# EAGLE design Carolo_schaltplan (EAGLE 9.5.2)
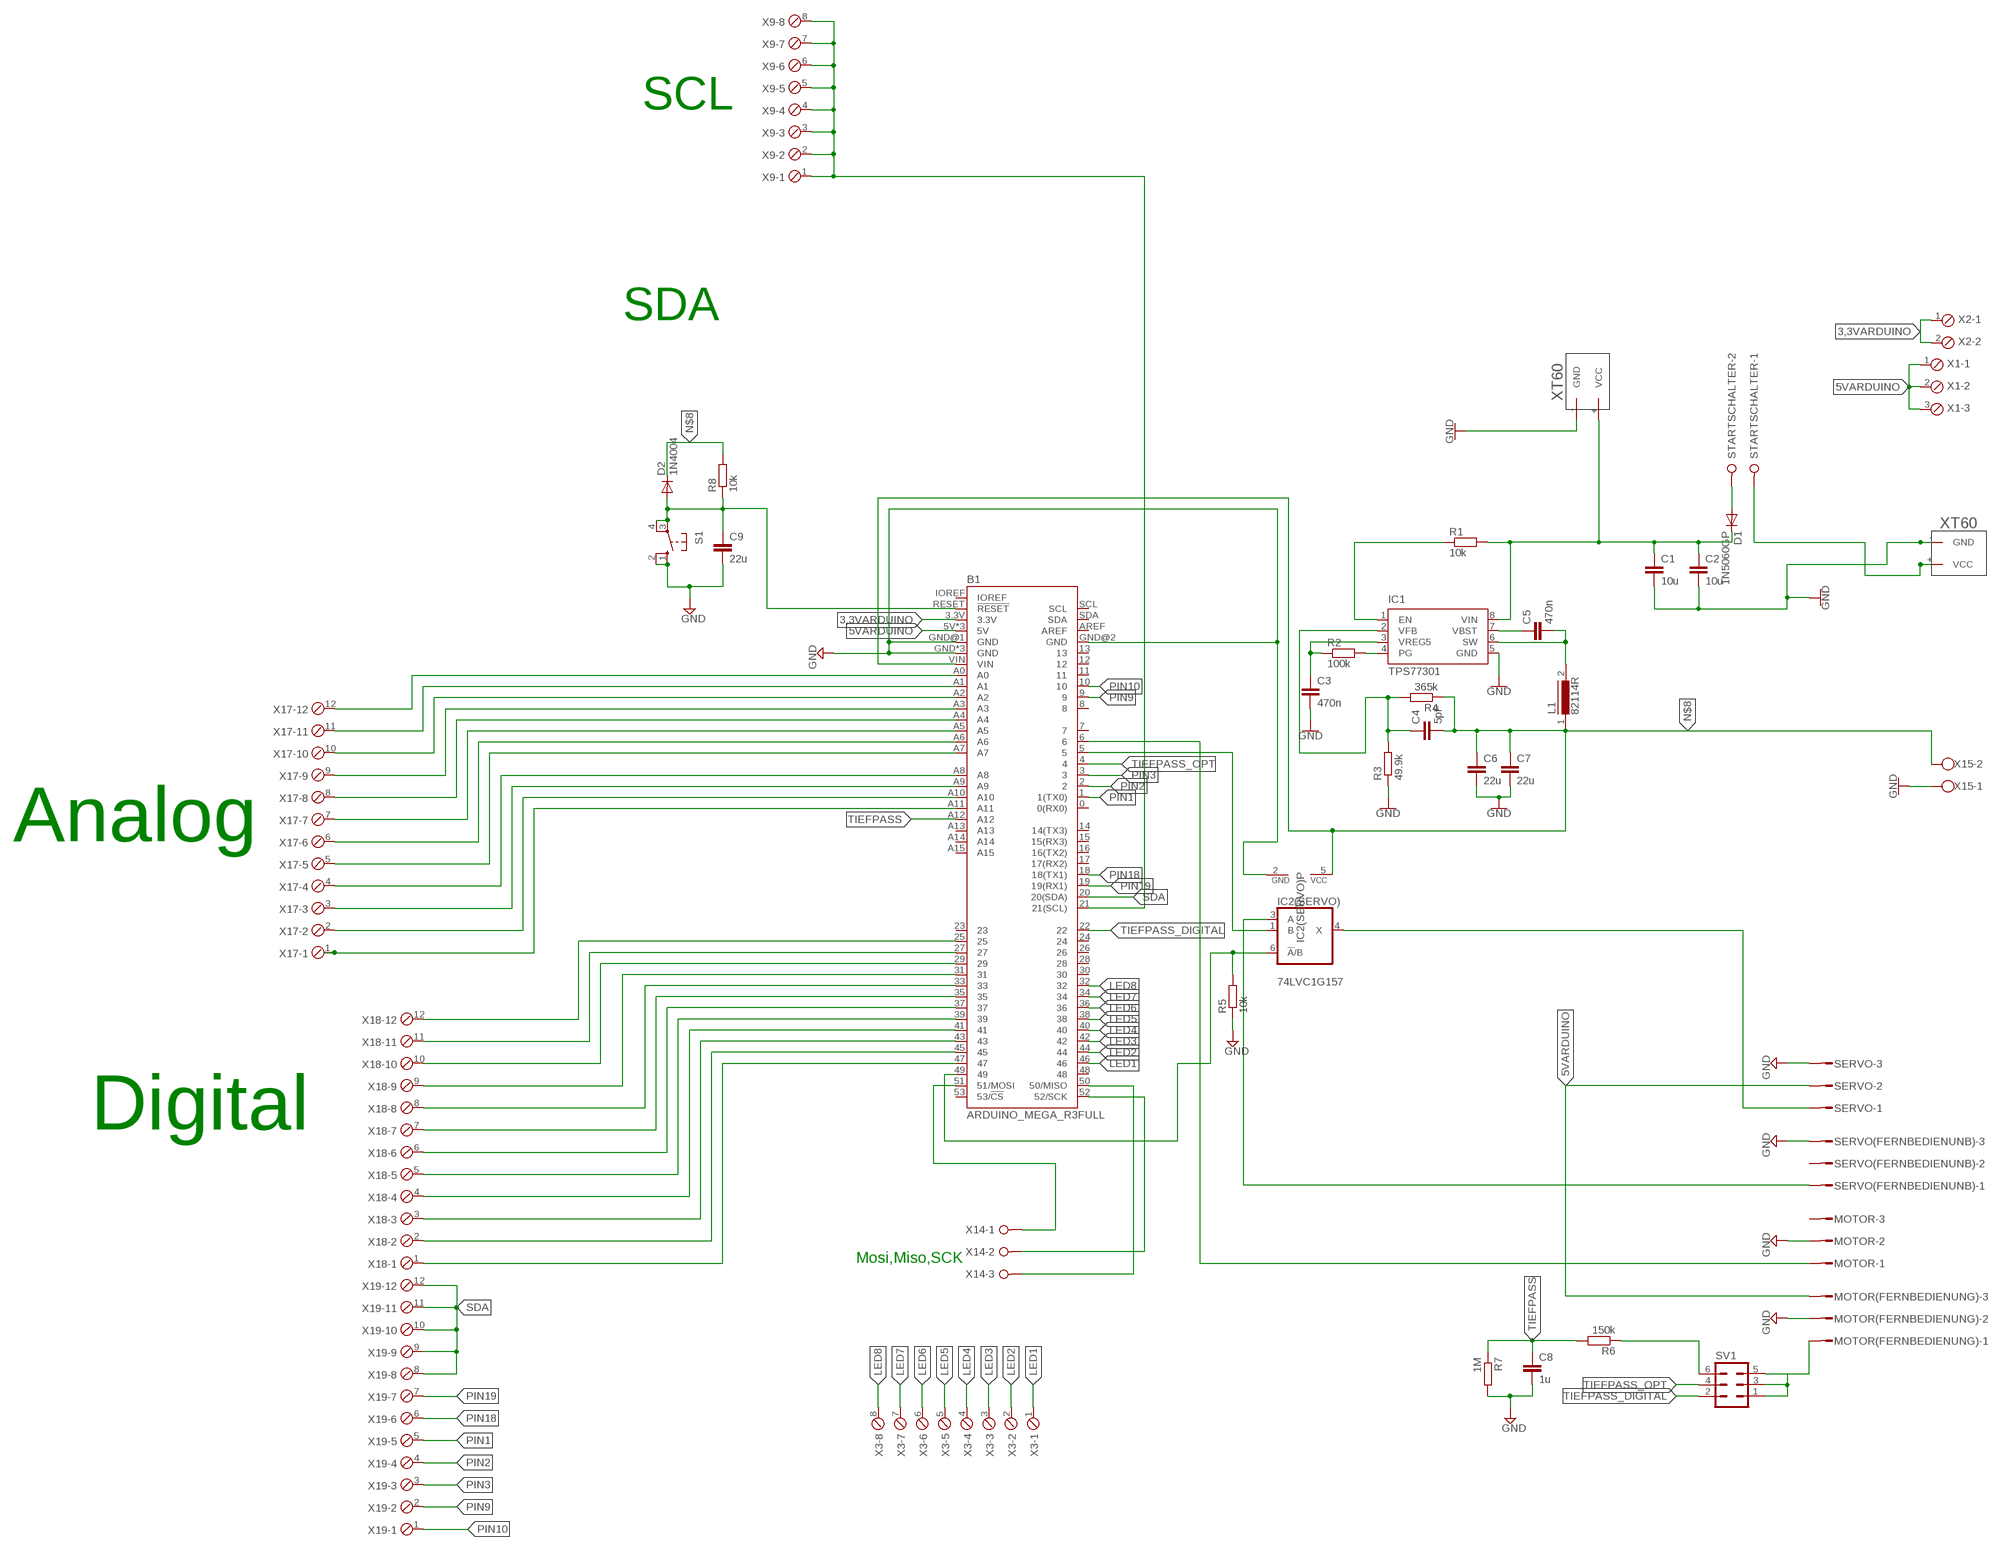
[diagram p0: schematic, sheet 1]

## Parts
B1  ARDUINO_MEGA_R3FULL  [ARDUINO_MEGA_NO_SILK]
C1  10u  C5/2.5  [C5B2.5]
C2  10u  C5/2.5  [C5B2.5]
C3  470n  C5/2.5  [C5B2.5]
C4  5pF  C5/2.5  [C5B2.5]
C5  470n  C5/2.5  [C5B2.5]
C6  22u  C5/2.5  [C5B2.5]
C7  22u  C5/2.5  [C5B2.5]
C8  1u  C5/2.5  [C5B2.5]
C9  22u  C5/2.5  [C5B2.5]
D1  1N5060GP  [DO15-12]
D2  1N4004  [DO41-10]
IC1  TPS77301  [SOP-08]
IC2(SERVO)  74LVC1G157  741G3157DBVR  [DBV_R-PDSO-G6]
L1  82114R  [82114R]
MOTOR  L03P  [L03P]
MOTOR(FERNBEDIENUNG)  L03P  [L03P]
R1  10k  R-EU_0309/12  [0309/12]
R2  100k  R-EU_0309/12  [0309/12]
R3  49.9k  R-EU_0309/12  [0309/12]
R4  365k  R-EU_0309/12  [0309/12]
R5  10k  R-EU_0309/12  [0309/12]
R6  150k  R-EU_0309/12  [0309/12]
R7  1M  R-EU_0309/12  [0309/12]
R8  10k  R-EU_0309/12  [0309/12]
S1  10-XX  [B3F-10XX]
SERVO  L03P  [L03P]
SERVO(FERNBEDIENUNB)  L03P  [L03P]
STARTSCHALTER  W237-02P  [W237-132]
SV1  ML6  [ML6]
U$1  XT60  [XT60]
U$2  XT60  [XT60]
X1  MPT3  [3POL254]
X2  MPT2  [2POL254]
X3  MPT8  [8POL254]
X9  MPT8  [8POL254]
X14  W237-03P  [W237-133]
X15  W237-102  [W237-102]
X17  MPT12  [12POL254]
X18  MPT12  [12POL254]
X19  MPT12  [12POL254]

## Nets
3,3VARDUINO: B1.3.3V X2.1 X2.2
5VARDUINO: B1.5V B1.5V@1(5V) B1.5V@2(5V) MOTOR(FERNBEDIENUNG).3 SERVO.2 X1.1 X1.2 X1.3
D22: B1.25 X18.12
D24: B1.29 X18.10
D26: B1.33 X18.8
GND: B1.GND B1.GND@1(GND) B1.GND@2(GND) B1.GND@3(GND) B1.GND@4(GND) C1.2 C2.2 C3.2 C6.2 C7.2 C8.2 C9.2 IC1.5(GND) IC2(SERVO).2(GND) MOTOR(FERNBEDIENUNG).2 MOTOR.2 R3.1 R5.1 R7.2 S1.1(S) S1.2(S1) SERVO(FERNBEDIENUNB).3 SERVO.3 U$1.-(GND) U$2.-(GND) X15.1
LED1: B1.46 X3.1
LED2: B1.44 X3.2
LED3: B1.42 X3.3
LED4: B1.40 X3.4
LED5: B1.38 X3.5
LED6: B1.36 X3.6
LED7: B1.34 X3.7
LED8: B1.32 X3.8
N$1: B1.RESET(!RESET) C9.1 D2.A R8.1 S1.3(P) S1.4(P1)
N$2: C1.1 C2.1 D1.C IC1.8(VIN) R1.2 U$2.+(VCC)
N$3: C4.1 IC1.2(VFB) R3.2 R4.2
N$4: IC1.4(PG) R2.2
N$5: B1.27 X18.11
N$7: C5.1 IC1.7(VBST)
N$8: B1.VIN C4.2 C6.1 C7.1 D2.C IC2(SERVO).5(VCC) L1.1 R4.1 R8.2 X15.2
N$9: B1.A0 X17.12
N$11: STARTSCHALTER.1 U$1.+(VCC)
N$12: B1.31 X18.9
N$13: IC2(SERVO).4(X) SERVO.1
N$14: B1.5 IC2(SERVO).1(B)
N$15: D1.A STARTSCHALTER.2
N$16: IC2(SERVO).3(A) SERVO(FERNBEDIENUNB).1
N$17: B1.6 MOTOR.1
N$18: B1.A2 X17.10
N$19: B1.A3 X17.9
N$20: B1.A4 X17.8
N$21: B1.A5 X17.7
N$22: B1.A6 X17.6
N$23: B1.A7 X17.5
N$24: B1.A8 X17.4
N$25: B1.A9 X17.3
N$26: B1.A10 X17.2
N$27: B1.A11 X17.1
N$28: B1.35 X18.7
N$29: B1.21(21(SCL)) X9.1 X9.2 X9.3 X9.4 X9.5 X9.6 X9.7 X9.8
N$30: B1.37 X18.6
N$31: B1.39 X18.5
N$32: B1.41 X18.4
N$33: B1.43 X18.3
N$34: B1.45 X18.2
N$35: B1.47 X18.1
N$36: B1.52(52/SCK) X14.2
N$37: R6.1 SV1.6
N$38: MOTOR(FERNBEDIENUNG).1 SV1.1 SV1.3 SV1.5
N$41: IC1.1(EN) R1.1
N$42: B1.51(51/MOSI) X14.1
N$44: B1.50(50/MISO) X14.3
N$51: C5.2 IC1.6(SW) L1.2
N$52: C3.1 IC1.3(VREG5) R2.1
N$55: B1.A1 X17.11
PIN1: B1.1(1(TX0)) X19.5
PIN2: B1.2 X19.4
PIN3: B1.3 X19.3
PIN9: B1.9 X19.2
PIN10: B1.10 X19.1
PIN18: B1.18(18(TX1)) X19.6
PIN19: B1.19(19(RX1)) X19.7
SDA: B1.20(20(SDA)) X19.8 X19.9 X19.10 X19.11 X19.12
SL: B1.49 IC2(SERVO).6(!A!/B) R5.2
TIEFPASS: B1.A12 C8.1 R6.2 R7.1
TIEFPASS_DIGITAL: B1.22 SV1.2
TIEFPASS_OPT: B1.4 SV1.4
Unconnected: B1.0(0(RX0)) B1.7 B1.8 B1.11 B1.12 B1.13 B1.14(14(TX3)) B1.15(15(RX3)) B1.16(16(TX2)) B1.17(17(RX2)) B1.23 B1.24 B1.26 B1.28 B1.30 B1.48 B1.53(53/!CS) B1.A13 B1.A14 B1.A15 B1.AREF B1.IOREF B1.SCL B1.SDA MOTOR.3 SERVO(FERNBEDIENUNB).2

## Notes on the sheet
- SCL
- SDA
- Analog
- Digital
- Mosi,Miso,SCK

## Library data of the parts
B1 = SparkFun-Boards:ARDUINO_MEGA_R3: Arduino Mega R3 ATmega2560 R3 compatible footprint. SparkFun Products: Arduino Mega 2560 R3 <https://www.sparkfun.com/products/11061>
C1-C9 = capacitor-wima:C: CAPACITOR naming: grid - package width
D1 = diode:1N5060GP: DIODE controlled avalanche rectifier
D2 = diode:1N4004: DIODE general purpose rectifier, 1 A
IC1 = texas:TPS773*: 250-mA LDO REGULATORS WITH RESET OUTPUT WITH 8-PIN MSOP PACKAGING Source: http://focus.ti.com/lit/ds/symlink/tps77333.pdf; MF: TEXAS INSTRUMENT CONNECTORS; MPN: TPS77301DGK; OC_FARNELL: 1510194; OC_NEWARK: 77C1213
IC2(SERVO) = 74xx-little-us:74*1G3157: Single-Pole, Double-Throw Analog Switch Source: http://focus.ti.com/lit/ds/symlink/sn74lvc1g3157.pdf
L1 = inductors:82114R: INDUCTOR
MOTOR MOTOR(FERNBEDIENUNG) SERVO SERVO(FERNBEDIENUNB) = con-amp-mt:L03P: AMP MT CONNECTOR; OC_FARNELL: unknown; OC_NEWARK: unknown
R1-R8 = resistor:R-EU_: RESISTOR, European symbol
S1 = switch-omron:10-XX: OMRON SWITCH; MPN: B3F-1000; OC_FARNELL: 176432; OC_NEWARK: 36M3542
STARTSCHALTER = con-wago-508:W237-02P: WAGO SREW CLAMP; OC_FARNELL: unknown; OC_NEWARK: unknown
SV1 = con-harting-ml:ML6: HARTING; OC_FARNELL: unknown; OC_NEWARK: unknown
U$1 U$2 = XT60:XT60: XT60
X1 = con-phoenix-254:MPT3: PHOENIX CONNECTOR; OC_FARNELL: unknown; OC_NEWARK: unknown
X2 = con-phoenix-254:MPT2: PHOENIX CONNECTOR; OC_FARNELL: unknown; OC_NEWARK: unknown
X3 X9 = con-phoenix-254:MPT8: PHOENIX CONNECTOR; OC_FARNELL: unknown; OC_NEWARK: unknown
X14 = con-wago-508:W237-03P: WAGO SREW CLAMP; OC_FARNELL: unknown; OC_NEWARK: unknown
X15 = con-wago-500:W237-102: WAGO SCREW CLAMP; MPN: 237-102; OC_FARNELL: unknown; OC_NEWARK: 70K9898
X17-X19 = con-phoenix-254:MPT12: PHOENIX CONNECTOR; OC_FARNELL: unknown; OC_NEWARK: unknown

## Board
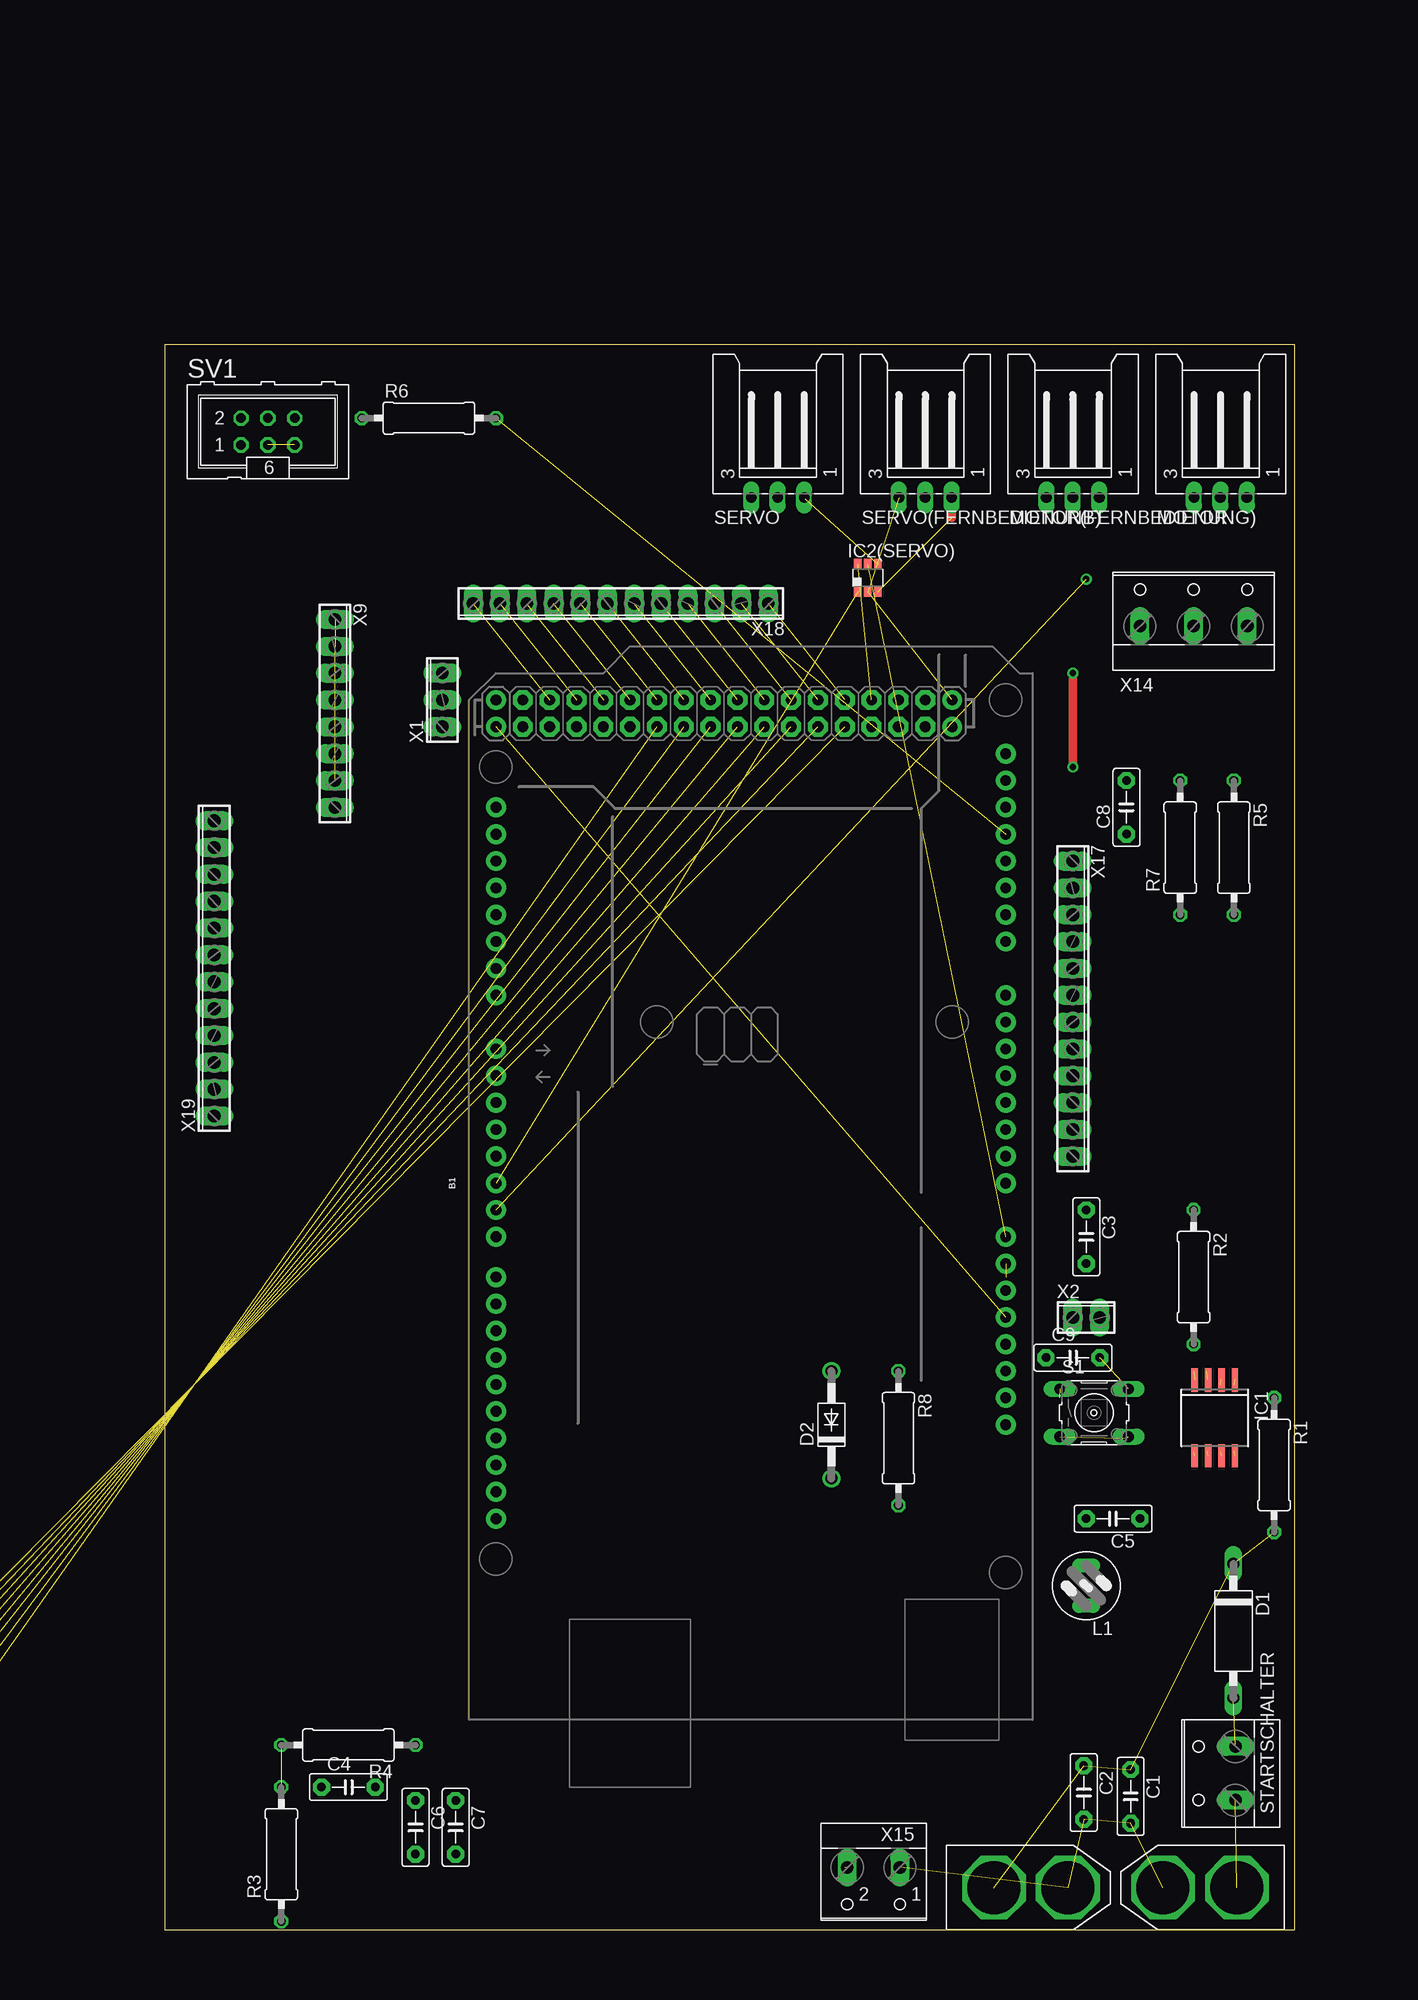
[diagram p1: board, top side]
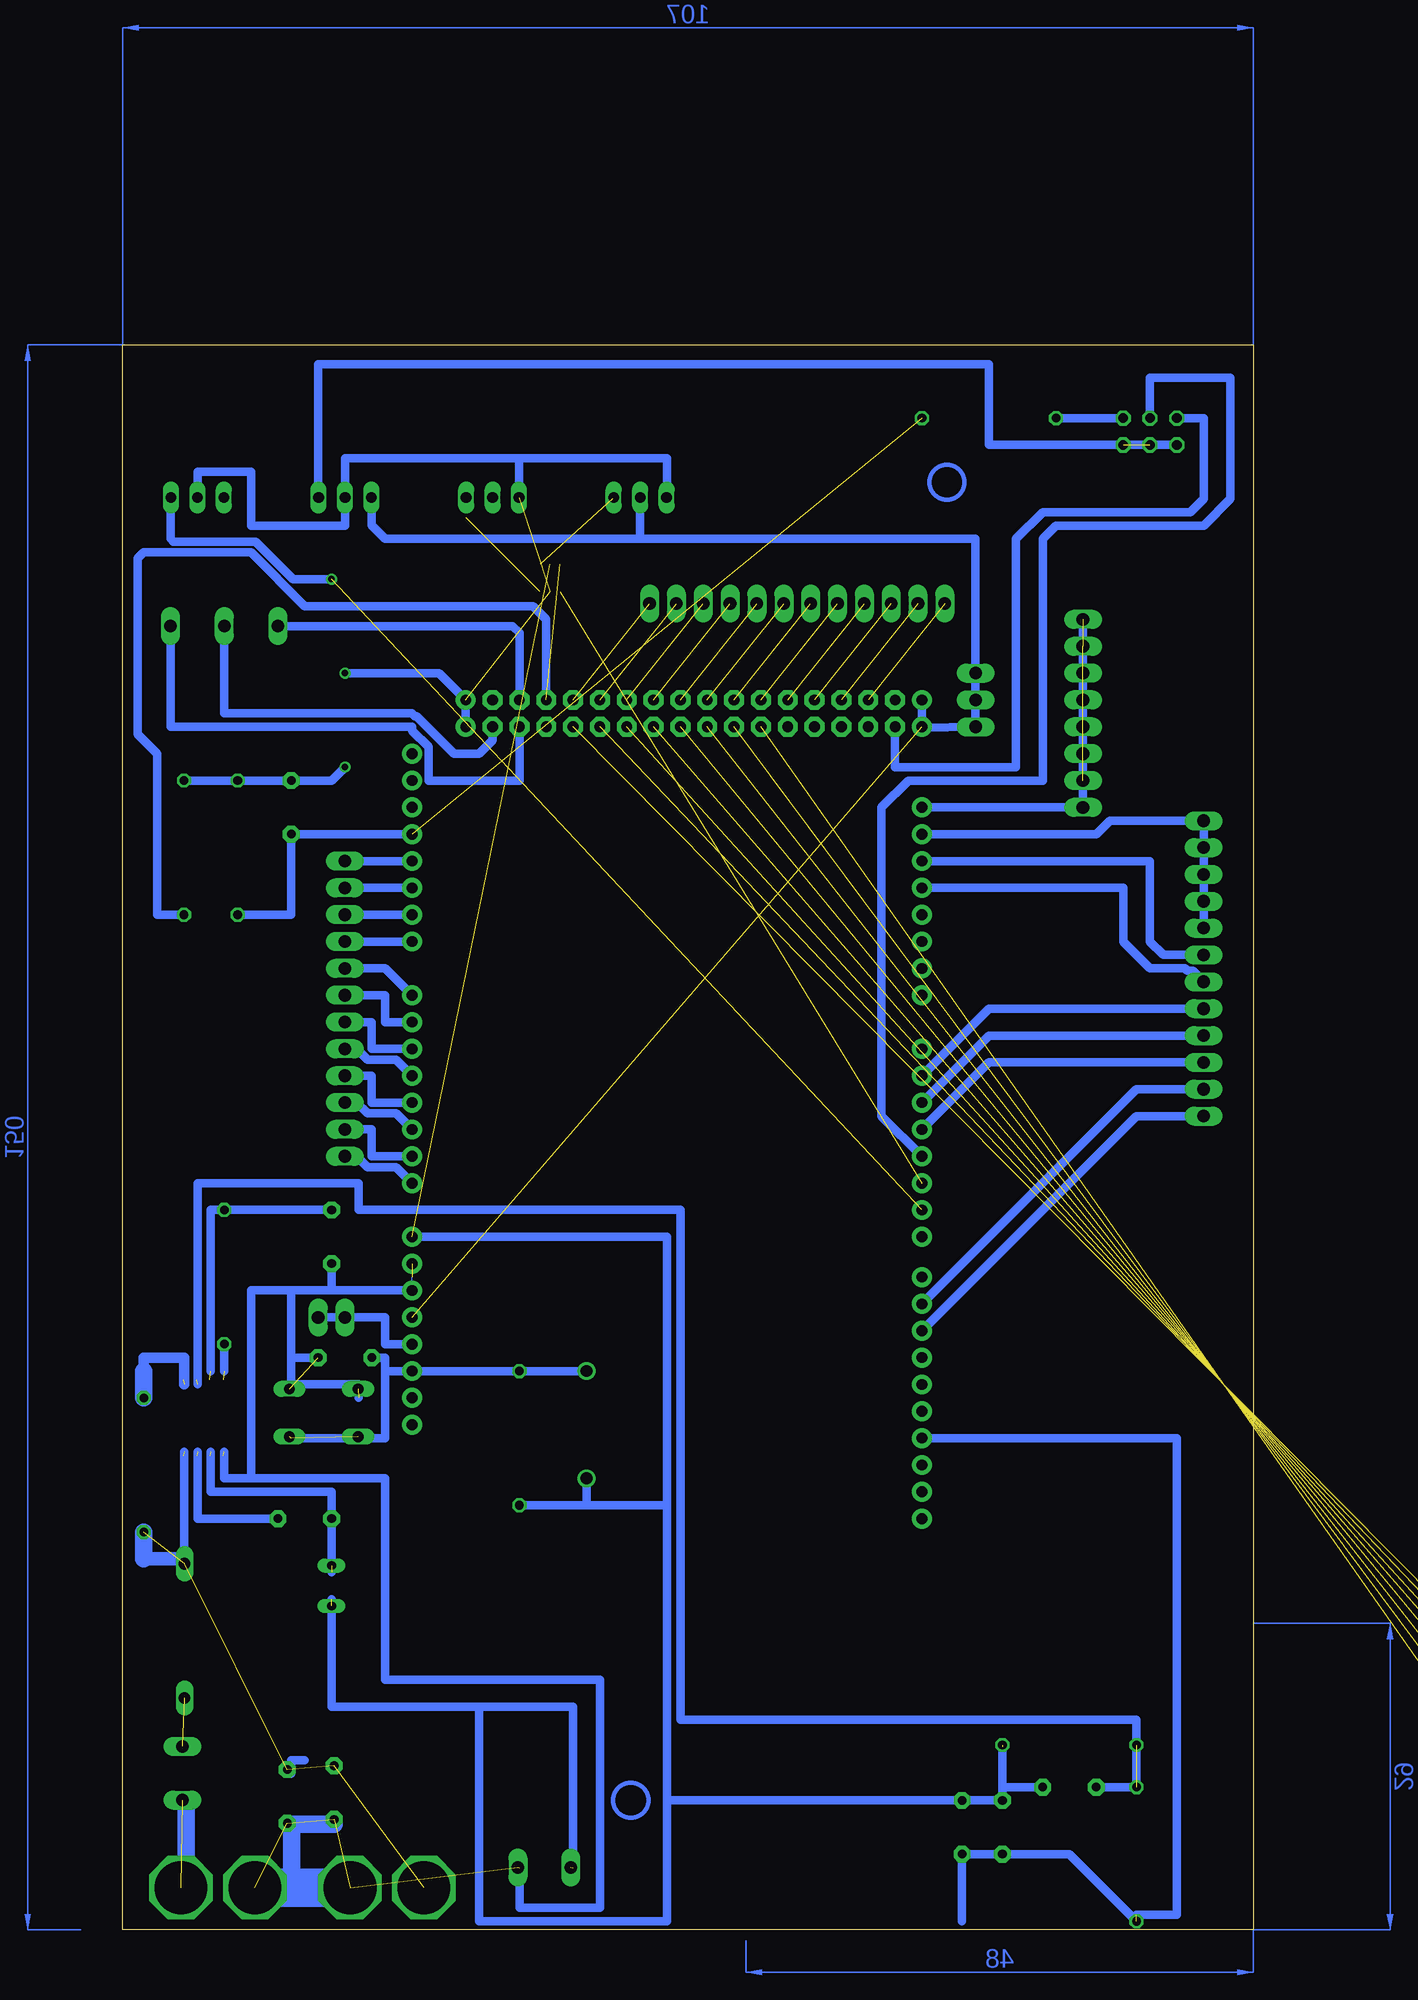
[diagram p2: board, bottom side, seen from below]

Size 107 x 150 mm. Coordinates in mm from the lower left corner, seen from the top.
Outline: 0,0 107,0 107,150 0,150 0,0
Copper layers (1*16): Top 0.035mm / dielectric 1.5mm / Bottom 0.035mm
Design rules "default": minimum track width 10mil, minimum drill 24mil, track to track 8mil, track to pad 8mil, pad to pad 8mil, via to via 8mil, smd to smd 8mil, copper to edge 40mil, drill to drill 8mil, minimum pad ring 10mil, minimum via ring 8mil, stop-mask expansion 4mil, vias tented up to drill 0mil, thermal gap 10mil

### Footprints (pad centres in the part's own frame; a part is rotated, then mirrored left to right if it is on the bottom)
ARDUINO_MEGA_NO_SILK = drill 1.016 pad 1.88: 0 13.97,24.13; 1 11.43,24.13; 2 8.89,24.13; 3 6.35,24.13; 3.3V -13.97,-24.13; 4 3.81,24.13; 5 1.27,24.13; 5V -11.43,-24.13; 5V@1 44.45,24.13; 5V@2 46.99,24.13; 6 -1.27,24.13; 7 -3.81,24.13; 8 -7.62,24.13; 9 -10.16,24.13; 10 -12.7,24.13; 11 -15.24,24.13; 12 -17.78,24.13; 13 -20.32,24.13; 14 19.05,24.13; 15 21.59,24.13; 16 24.13,24.13; 17 26.67,24.13; 18 29.21,24.13; 19 31.75,24.13; 20 34.29,24.13; 21 36.83,24.13; A0 1.27,-24.13; A1 3.81,-24.13; A2 6.35,-24.13; A3 8.89,-24.13; A4 11.43,-24.13; A5 13.97,-24.13; A6 16.51,-24.13; A7 19.05,-24.13; A8 24.13,-24.13; A9 26.67,-24.13; A10 29.21,-24.13; A11 31.75,-24.13; A12 34.29,-24.13; A13 36.83,-24.13; A14 39.37,-24.13; A15 41.91,-24.13; AREF -25.4,24.13; GND -8.89,-24.13; GND@1 -6.35,-24.13; GND@2 44.45,-19.05; GND@3 46.99,-19.05; GND@4 -22.86,24.13; IOREF -19.05,-24.13; NC -21.59,-24.13; RESET -16.51,-24.13; SCL -30.48,24.13; SDA -27.94,24.13; VIN -3.81,-24.13 | drill 1.016 pad 1.88 octagon: 22 44.45,21.59; 23 46.99,21.59; 24 44.45,19.05; 25 46.99,19.05; 26 44.45,16.51; 27 46.99,16.51; 28 44.45,13.97; 29 46.99,13.97; 30 44.45,11.43; 31 46.99,11.43; 32 44.45,8.89; 33 46.99,8.89; 34 44.45,6.35; 35 46.99,6.35; 36 44.45,3.81; 37 46.99,3.81; 38 44.45,1.27; 39 46.99,1.27; 40 44.45,-1.27; 41 46.99,-1.27; 42 44.45,-3.81; 43 46.99,-3.81; 44 44.45,-6.35; 45 46.99,-6.35; 46 44.45,-8.89; 47 46.99,-8.89; 48 44.45,-11.43; 49 46.99,-11.43; 50 44.45,-13.97; 51 46.99,-13.97; 52 44.45,-16.51; 53 46.99,-16.51
C5B2.5 = drill 0.813 pad 1.6 octagon: 1 -2.54,0; 2 2.54,0
DO15-12 = drill 1.118 long: A 6.35,0; C -6.35,0
DO41-10 = drill 1.118: A 5.08,0; C -5.08,0
SOP-08 = smd 0.6 x 2.2: 1 -1.905,-3.6; 2 -0.635,-3.6; 3 0.635,-3.6; 4 1.905,-3.6; 5 1.905,3.575; 6 0.635,3.575; 7 -0.635,3.575; 8 -1.905,3.575
DBV_R-PDSO-G6 = smd 0.69 x 0.99: 1 -0.95,-1.29; 2 0,-1.29; 3 0.95,-1.29; 4 0.95,1.3; 5 0,1.3; 6 -0.95,1.3
82114R = drill 0.813 long: 1 0,1.905; 2 0,-1.905
L03P = drill 1.016 long: 1 2.5,-6.25; 2 0,-6.25; 3 -2.5,-6.25
0309/12 = drill 0.813 octagon: 1 -6.35,0; 2 6.35,0
B3F-10XX = drill 1.016 long: 1 -3.251,2.261; 2 3.251,2.261; 3 -3.251,-2.261; 4 3.251,-2.261
W237-132 = drill 1.194 long: 1 -2.54,-0.635; 2 2.54,-0.635
ML6 = drill 0.914 octagon: 1 -2.54,-1.27; 2 -2.54,1.27; 3 0,-1.27; 4 0,1.27; 5 2.54,-1.27; 6 2.54,1.27
XT60 = drill 5 octagon: + 4.5,0; - 11.5,0
3POL254 = drill 1.2 long: 1 -2.54,0; 2 0,0; 3 2.54,0
2POL254 = drill 1.2 long: 1 -1.27,0; 2 1.27,0
8POL254 = drill 1.2 long: 1 -8.89,0; 2 -6.35,0; 3 -3.81,0; 4 -1.27,0; 5 1.27,0; 6 3.81,0; 7 6.35,0; 8 8.89,0
W237-133 = drill 1.194 long: 1 -5.08,-0.635; 2 0,-0.635; 3 5.08,-0.635
W237-102 = drill 1.194 long: 1 -2.5,-1.27; 2 2.5,-1.27
12POL254 = drill 1.2 long: 1 -13.97,0; 2 -11.43,0; 3 -8.89,0; 4 -6.35,0; 5 -3.81,0; 6 -1.27,0; 7 1.27,0; 8 3.81,0; 9 6.35,0; 10 8.89,0; 11 11.43,0; 12 13.97,0

### Placement (x,y rotation side)
B1  55.49,69.4 90 top
C1  91.44,12.64 270 top
C2  87,13 270 top
C3  87.24,65.59 270 top
C4  17.39,13.52 0 top
C5  89.78,38.92 180 top
C6  23.74,9.71 270 top
C7  27.55,9.71 270 top
C8  91.05,106.23 90 top
C9  85.97,54.16 0 top
D1  101.17,28.3 270 top
D2  63.11,47.81 90 top
IC1  99.4,48.45 180 top
IC2(SERVO)  66.56,127.94 0 top
L1  87.24,32.57 180 top
MOTOR  99.94,141.79 0 top
MOTOR(FERNBEDIENUNG)  85.97,141.79 0 top
R1  105.02,44 270 top
R2  97.4,61.78 270 top
R3  11.04,7.17 90 top
R4  17.39,17.5 180 top
R5  101.21,102.42 270 top
R6  25.01,143.06 0 top
R7  96.13,102.42 90 top
R8  69.46,46.54 270 top
S1  87.98,48.94 0 top
SERVO  58.03,141.79 0 top
SERVO(FERNBEDIENUNB)  72,141.79 0 top
STARTSCHALTER  100.72,14.82 90 top
SV1  9.77,141.79 0 top
U$1  106,4 180 top
U$2  74,4 0 top
X1  26.28,116.39 90 top
X2  87.24,57.97 0 top
X3  -49.92,-10.61 0 top  (outside the outline)
X9  16.12,115.12 270 top
X14  97.4,124.01 0 top
X15  67.1,4.64 180 top
X17  85.97,87.18 270 top
X18  43.17,125.51 180 top
X19  4.69,90.99 90 top

### Tracks (layer width: path | path; a pad name or v marks a point on that pad's centre or on a via)
3,3VARDUINO
  Bottom 0.813: B1.3.3V 82.16,55.43 82.16,57.97 X2.1 X2.2
5VARDUINO  (1 unrouted)
  Bottom 0.813: B1.5V@1 B1.5V@2 31.36,113.74 X1.1 X1.2 X1.3 26.28,131.63 58.03,131.63 | 58.03,131.63 SERVO.2 | MOTOR(FERNBEDIENUNG).3 83.47,132.94 82.16,131.63 58.03,131.63
D22  (1 unrouted)
D24  (1 unrouted)
D26  (1 unrouted)
GND  (via drill 0.61)  (12 unrouted)
  Top 0.813: v85.97,118.93 v85.97,110.04
  Bottom 0: B1.GND 79.62,61.78
  Bottom 0.813: 69.46,5.9 69.46,2.09 61.84,2.09 61.84,23.68 82.16,23.68 82.16,42.73 94.86,42.73 | 97.4,45.27 97.4,42.73 94.86,42.73 | 94.86,42.73 94.86,60.51 91.05,60.51 | B1.GND 87.24,60.51 | 87.24,60.51 91.05,60.51 | C3.2 87.24,60.51 | 27.55,0.82 C7.2 C6.2 17.39,7.17 R3.1 | 91.05,54.16 91.05,51.62 84.7,51.62 84.7,50.35 | 91.05,54.16 91.05,60.51 | C9.2 91.05,54.16 | B1.GND@2 B1.GND@3 77.08,118.93 v85.97,118.93 | R5.1 R7.2 C8.2 87.24,108.77 v85.97,110.04 | 11.04,1.42 7.23,1.42 7.23,46.54 B1.GND@4 | SERVO.3 55.49,135.58 55.49,139.25 69.46,139.25 | 69.46,139.25 69.5,139.21 SERVO(FERNBEDIENUNB).3 | 69.46,139.25 85.97,139.25 MOTOR(FERNBEDIENUNG).2 85.97,132.9 94.86,132.9 94.86,137.98 99.94,137.98 MOTOR.2
LED1  (1 unrouted)
LED2  (1 unrouted)
LED3  (1 unrouted)
LED4  (1 unrouted)
LED5  (1 unrouted)
LED6  (1 unrouted)
LED7  (1 unrouted)
LED8  (1 unrouted)
N$1  (2 unrouted)
  Bottom 0.813: 82.16,52.89 B1.RESET R8.1 D2.A | 82.16,52.89 82.16,54.16 C9.1 | 82.16,52.89 82.16,46.54 91.05,46.54
N$2  (5 unrouted)
  Bottom 0.813: 101.21,45.27 101.21,35.11
  Bottom 1.27: 101.21,35.11 105.02,35.11
  Bottom 1.676: 105.02,35.11 R1.2
N$3  (2 unrouted)
  Bottom 0.813: 99.94,51.62 99.94,70.67 84.7,70.67 84.7,68.13 54.22,68.13 54.22,19.87 11.04,19.87 R3.2 C4.1
N$4  (1 unrouted)
  Bottom 0.813: 97.4,52.89 R2.2
N$5  (1 unrouted)
N$7  (1 unrouted)
  Bottom 0.813: 99.94,45.27 99.94,38.92 C5.1
N$8  (4 unrouted)
  Bottom 0.813: 64.38,5.9 64.38,21.14 73.27,21.14 | 73.27,21.14 87.24,21.14 87.24,31.3 | 73.27,21.14 73.27,0.82 55.49,0.82 55.49,12.25 | 55.49,12.25 55.49,40.19 | 55.49,40.19 55.49,65.59 B1.VIN | C4.2 23.74,13.52 | 23.74,13.52 C6.1 C7.1 55.49,12.25 | 23.74,13.52 23.74,17.33 | D2.C 63.11,40.19 R8.2 55.49,40.19
N$9
  Bottom 0.813: B1.A0 81.14,72.19 83.43,72.19 83.85,72.19 84.87,73.21 X17.12
N$10
  Bottom 1.676: 101,5 101,12
N$11  (1 unrouted)
N$12  (1 unrouted)
N$13  (1 unrouted)
  Top 0.813: SERVO.1 60.63,135.44
N$14  (1 unrouted)
N$15  (1 unrouted)
N$16  (1 unrouted)
  Top 0.813: 74.5,133.64 SERVO(FERNBEDIENUNB).1
N$17  (via drill 0.61)  (1 unrouted)
  Bottom 0.813: MOTOR.1 102.48,135.5 102.48,131.63 102.23,131.38 94.44,131.38 90.88,127.82 v87.24,127.82
N$18
  Bottom 0.813: B1.A2 81.14,77.27 83.85,77.27 84.87,78.29 X17.10
N$19
  Bottom 0.813: B1.A3 83.43,78.29 83.43,80.83 X17.9
N$20
  Bottom 0.813: B1.A4 81.14,82.35 83.85,82.35 84.87,83.37 X17.8
N$21
  Bottom 0.813: B1.A5 83.43,83.37 83.43,85.91 X17.7
N$22
  Bottom 0.813: B1.A6 82.16,85.91 82.16,88.45 X17.6
N$23
  Bottom 0.813: B1.A7 82.16,90.99 X17.5
N$24
  Bottom 0.813: B1.A8 X17.4
N$25
  Bottom 0.813: B1.A9 X17.3
N$26
  Bottom 0.813: B1.A10 X17.2
N$27
  Bottom 0.813: B1.A11 X17.1
N$28  (1 unrouted)
N$29  (6 unrouted)
  Bottom 0.813: B1.21 X9.8 X9.1
N$30  (1 unrouted)
N$31  (1 unrouted)
N$32  (1 unrouted)
N$33  (1 unrouted)
N$34  (1 unrouted)
N$35  (1 unrouted)
N$36
  Bottom 0.813: B1.52 72,112.58 73.27,111.31 75.64,111.31 79.2,114.87 79.37,114.87 79.62,115.12 97.4,115.12 X14.2
N$37
  Bottom 0.813: SV1.6 R6.1
N$38  (1 unrouted)
  Bottom 0.813: SV1.1 SV1.5 25.01,140.52 25.01,148.14 88.51,148.14 88.51,135.54 MOTOR(FERNBEDIENUNG).1
N$40
  Bottom 1.676: 86,5 91,5 | 91,5 96,5 96,4 86,4 86,3 96,3 | 91,5 91,10 87,10
N$41  (1 unrouted)
  Bottom 1.016: 101.21,51.62 101.21,54.16 105.02,54.16 105.02,52.89
  Bottom 1.676: R1.1 105.02,52.89
N$42
  Bottom 0.813: X14.1 70.09,123.38 69.46,122.74 B1.51
N$44
  Bottom 0.813: B1.50 69.46,108.77 78.07,108.77 78.07,111.95 79.62,113.5 79.62,113.85 102.48,113.85 X14.3
N$48
  Bottom 0.813: 91.05,14.79 91.05,16.06 89.78,16.06
N$51  (2 unrouted)
  Bottom 0.813: 98.67,45.27 98.67,41.46 87.24,41.46 C5.2 87.24,33.84
N$52  (1 unrouted)
  Bottom 0.813: 98.67,52.89 98.67,68.13 R2.1 C3.1
N$55
  Bottom 0.813: B1.A1 83.43,73.21 83.43,75.75 X17.11
PIN1
  Bottom 0.813: X19.5 25.01,87.18 B1.1
PIN2
  Bottom 0.813: X19.4 25.01,84.64 B1.2
PIN3
  Bottom 0.813: X19.3 25.01,82.1 B1.3
PIN9
  Bottom 0.813: X19.2 11.04,79.56 B1.9
PIN10
  Bottom 0.813: X19.1 11.04,77.02 B1.10
PIN18
  Bottom 0.813: X19.6 5.72,90.75 6.22,90.75 6.45,90.99 9.77,90.99 12.31,93.53 12.31,98.61 B1.18
PIN19
  Bottom 0.813: X19.7 8.5,92.26 9.77,93.53 9.77,101.15 B1.19
SDA
  Bottom 0.813: B1.20 14.85,103.69 13.58,104.96 X19.12 X19.11 X19.10 X19.9 X19.8
SL  (1 unrouted)
  Bottom 0.813: R5.2 103.75,96.07 103.75,111.31 105.58,113.14 105.58,129.8 105.02,130.36 94.86,130.36 89.78,125.28 68.19,125.28 66.92,124.01 B1.49
TIEFPASS  (1 unrouted)
  Bottom 0.813: B1.A12 C8.1 91.05,96.07 R7.1
TIEFPASS_DIGITAL
  Bottom 0.813: SV1.2 4.69,143.06 4.69,135.44 5.96,134.17 19.93,134.17 22.47,131.63 22.47,110.04 33.9,110.04 B1.22
TIEFPASS_OPT
  Bottom 0.813: SV1.4 9.77,146.87 2.15,146.87 2.15,135.44 4.69,132.9 18.66,132.9 19.93,131.63 19.93,108.77 32.63,108.77 35.17,106.23 35.17,77.02 B1.4
(copper drawn outside any net)
  shapes: Bottom area x5, Bottom circle x2